# Altium project Battery supply.PrjPcb
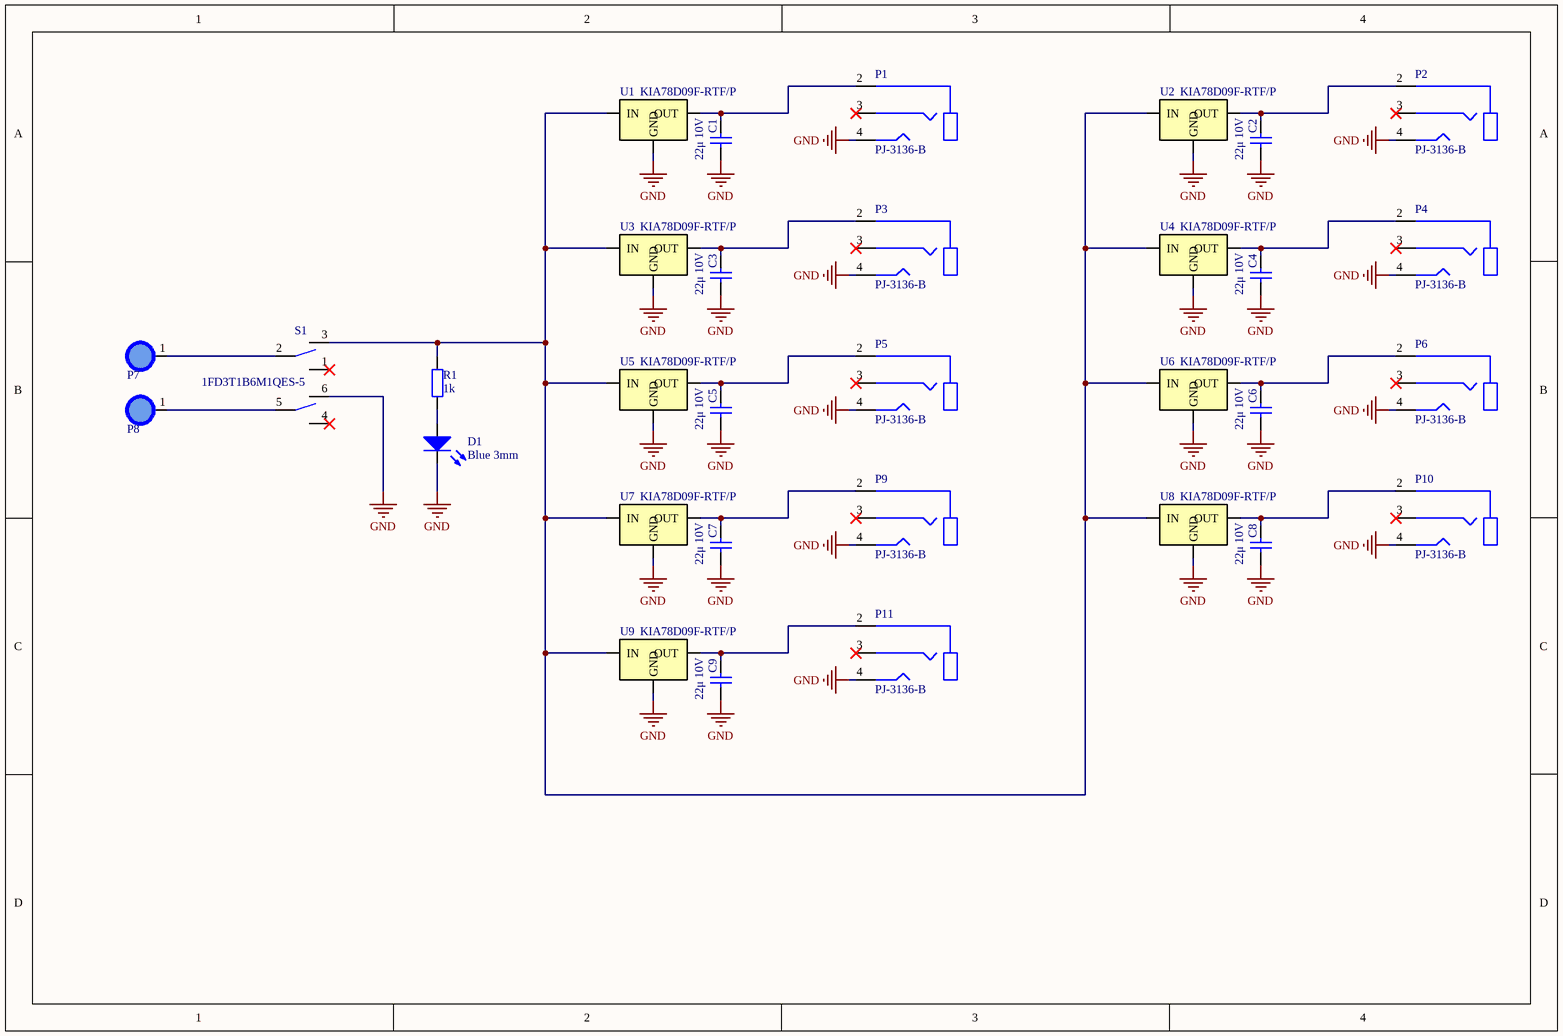
[diagram p0: Battery supply.SchDoc]
1 sheet, 32 parts. Net scope: global (net labels, ports and power ports of the same name join across sheets).
Board file: Battery supply.PcbDoc

## Sheet Battery supply.SchDoc
size A4; SheetNumber: 1; SheetTotal: 1

### Parts
C1  22μ 10V  [Capacitor 0603]
C2  22μ 10V  [Capacitor 0603]
C3  22μ 10V  [Capacitor 0603]
C4  22μ 10V  [Capacitor 0603]
C5  22μ 10V  [Capacitor 0603]
C6  22μ 10V  [Capacitor 0603]
C7  22μ 10V  [Capacitor 0603]
C8  22μ 10V  [Capacitor 0603]
C9  22μ 10V  [Capacitor 0603]
D1  Blue 3mm  [LED 3MM BLUE]
P1  PJ-3136-B  [PJ-3136-B]
P2  PJ-3136-B  [PJ-3136-B]
P3  PJ-3136-B  [PJ-3136-B]
P4  PJ-3136-B  [PJ-3136-B]
P5  PJ-3136-B  [PJ-3136-B]
P6  PJ-3136-B  [PJ-3136-B]
P7  PAd  [PAD]  (value not drawn)
P8  PAd  [PAD]  (value not drawn)
P9  PJ-3136-B  [PJ-3136-B]
P10  PJ-3136-B  [PJ-3136-B]
P11  PJ-3136-B  [PJ-3136-B]
R1  1k  [Resistor 0603]
S1  1FD3T1B6M1QES-5  [1FD3T1B6M1QES-5]
U1  KIA78D09F-RTF/P  [KIA78D09F-RTF/P]
U2  KIA78D09F-RTF/P  [KIA78D09F-RTF/P]
U3  KIA78D09F-RTF/P  [KIA78D09F-RTF/P]
U4  KIA78D09F-RTF/P  [KIA78D09F-RTF/P]
U5  KIA78D09F-RTF/P  [KIA78D09F-RTF/P]
U6  KIA78D09F-RTF/P  [KIA78D09F-RTF/P]
U7  KIA78D09F-RTF/P  [KIA78D09F-RTF/P]
U8  KIA78D09F-RTF/P  [KIA78D09F-RTF/P]
U9  KIA78D09F-RTF/P  [KIA78D09F-RTF/P]

### Nets
GND: C1.1 C2.1 C3.1 C4.1 C5.1 C6.1 C7.1 C8.1 C9.1 D1.1 P1.4 P2.4 P3.4 P4.4 P5.4 P6.4 P9.4 P10.4 P11.4 S1.6 U1.2(GND) U2.2(GND) U3.2(GND) U4.2(GND) U5.2(GND) U6.2(GND) U7.2(GND) U8.2(GND) U9.2(GND)
NetC1_2: C1.2 P1.2 U1.3(OUT)
NetC2_2: C2.2 P2.2 U2.3(OUT)
NetC3_2: C3.2 P3.2 U3.3(OUT)
NetC4_2: C4.2 P4.2 U4.3(OUT)
NetC5_2: C5.2 P5.2 U5.3(OUT)
NetC6_2: C6.2 P6.2 U6.3(OUT)
NetC7_2: C7.2 P9.2 U7.3(OUT)
NetC8_2: C8.2 P10.2 U8.3(OUT)
NetC9_2: C9.2 P11.2 U9.3(OUT)
NetD1_2: D1.2 R1.1
NetP7_1: P7.1 S1.2
NetP8_1: P8.1 S1.5
NetR1_2: R1.2 S1.3 U1.1(IN) U2.1(IN) U3.1(IN) U4.1(IN) U5.1(IN) U6.1(IN) U7.1(IN) U8.1(IN) U9.1(IN)

Not connected (* = marked no-connect by the designer): P1 3*; P2 3*; P3 3*; P4 3*; P5 3*; P6 3*; P9 3*; P10 3*; P11 3*; S1 1* 4*

### Library data of the parts
C1-C9 = Capacitor 22μF 0603 ±10% 10V: X5R ±20% 10V 22uF 0603 Multilayer Ceramic Capacitors MLCC - SMD/SMT ROHS; Mfr. Part #: 0603X226M100NT; Type: SMD; LCSC Part #: C60077; Package: 0603; ComponentLink1Description: Datasheet; ComponentLink1URL: https://datasheet.lcsc.com/lcsc/1811151152_FH-Guangdong-Fenghua-Advanced-Tech-0603X226M100NT_C60077.pdf
D1 = Diode LED Blue 3mm THT: Blue 460nm~470nm 2.7V~3.6V Through Hole Light Emitting Diodes (LED) ROHS; Mfr. Part #: TJ-L3FYTGCBMCGSFLC6B-A5; Type: THT; LCSC Part #: C330760; Package: Through Hole; ComponentLink1Description: Datasheet; ComponentLink1URL: https://datasheet.lcsc.com/lcsc/2006301911_TOGIALED-TJ-L3FYTGCBMCGSFLC6B-A5_C330760.pdf
P1-P6 P9-P11 = Mechanical Headphone Holder JACK PJ-3136-B: 3.5mm Plug-in headphone holder Horizontal 6 Female DIP Audio & Video Connectors ROHS; Mfr. Part #: PJ-3136-B; LCSC Part #: C381131; Package: DIP; ComponentLink1Description: Datasheet; ComponentLink1URL: https://datasheet.lcsc.com/lcsc/1912111437_XKB-Connectivity-PJ-3136-B_C381131.pdf; Type: THT
P7 P8 = Mechanical PAD 1mm: Pad 1mm
R1 = Resistor 1kΩ 0603 ±1% 0.1W: ±1% ±100ppm/℃ 1kΩ 0.1W 0603 Chip Resistor - Surface Mount ROHS; Mfr. Part #: RC0603FR-071KL; LCSC Part #: C22548; Package: 0603; ComponentLink1Description: Datasheet; ComponentLink1URL: https://datasheet.lcsc.com/lcsc/1810182020_YAGEO-RC0603FR-071KL_C22548.pdf; Type: SMD
S1 = Mechanical Toggle Switch ON-OFF-ON 1FD3T1B6M1QES-5: H=10.5mm Toggle Switches ROHS; Mfr. Part #: 1FD3T1B6M1QES-5; LCSC Part #: C908278; Package: H=10.5mm; ComponentLink1Description: Datasheet; ComponentLink1URL: https://datasheet.lcsc.com/lcsc/2011111736_Dailywell-1FD3T1B6M1QES-5_C908278.pdf; Type: THT
U1-U9 = IC LDO 9V 500mA KIA78D09F-RTF/P: 25V 500mV @ 500mA Fixed 9V TO-252-2(DPAK) Linear Voltage Regulators (LDO) ROHS; Mfr. Part #: KIA78D09F-RTF/P; LCSC Part #: C69764; Package: TO-252-2(DPAK); ComponentLink1Description: Datasheet; ComponentLink1URL: https://datasheet.lcsc.com/lcsc/1810121816_KEC-Semicon-KIA78D09F-RTF-P_C69764.pdf; Type: SMD